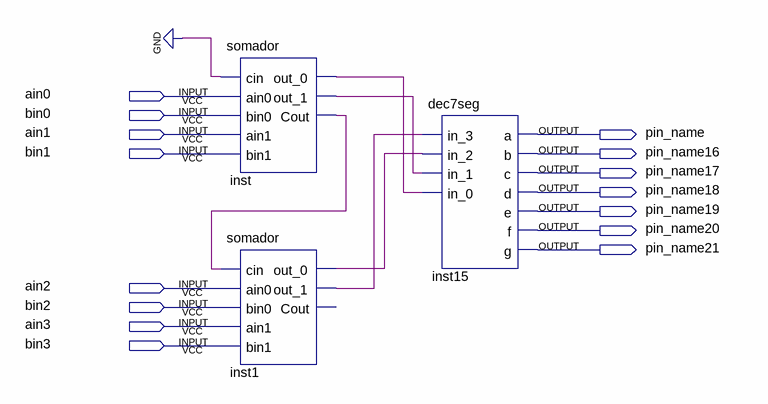
[diagram p0: schematic sheet]
// Quartus schematic sumdec.bdf as structural Verilog: 3 symbols, 15 pins
module sumdec (
  input  ain0,
  input  bin0,
  input  ain1,
  input  bin1,
  input  ain2,
  input  bin2,
  input  ain3,
  input  bin3,
  output pin_name,
  output pin_name16,
  output pin_name17,
  output pin_name18,
  output pin_name19,
  output pin_name20,
  output pin_name21
);

  wire inst1_out_0, inst1_out_1, inst_cout, inst_out_0, inst_out_1;

  somador inst (
    .cin(1'b0), .ain0(ain0), .bin0(bin0), .ain1(ain1), .bin1(bin1), .out_0(inst_out_0), .out_1(inst_out_1),
    .Cout(inst_cout));
  somador inst1 (
    .cin(inst_cout), .ain0(ain2), .bin0(bin2), .ain1(ain3), .bin1(bin3), .out_0(inst1_out_0),
    .out_1(inst1_out_1));  // open: Cout
  dec7seg inst15 (
    .in_3(inst1_out_1), .in_2(inst1_out_0), .in_1(inst_out_1), .in_0(inst_out_0), .a(pin_name),
    .b(pin_name16), .c(pin_name17), .d(pin_name18), .e(pin_name19), .f(pin_name20), .g(pin_name21));
endmodule
